# Altium project Measurement_board.PrjPcb
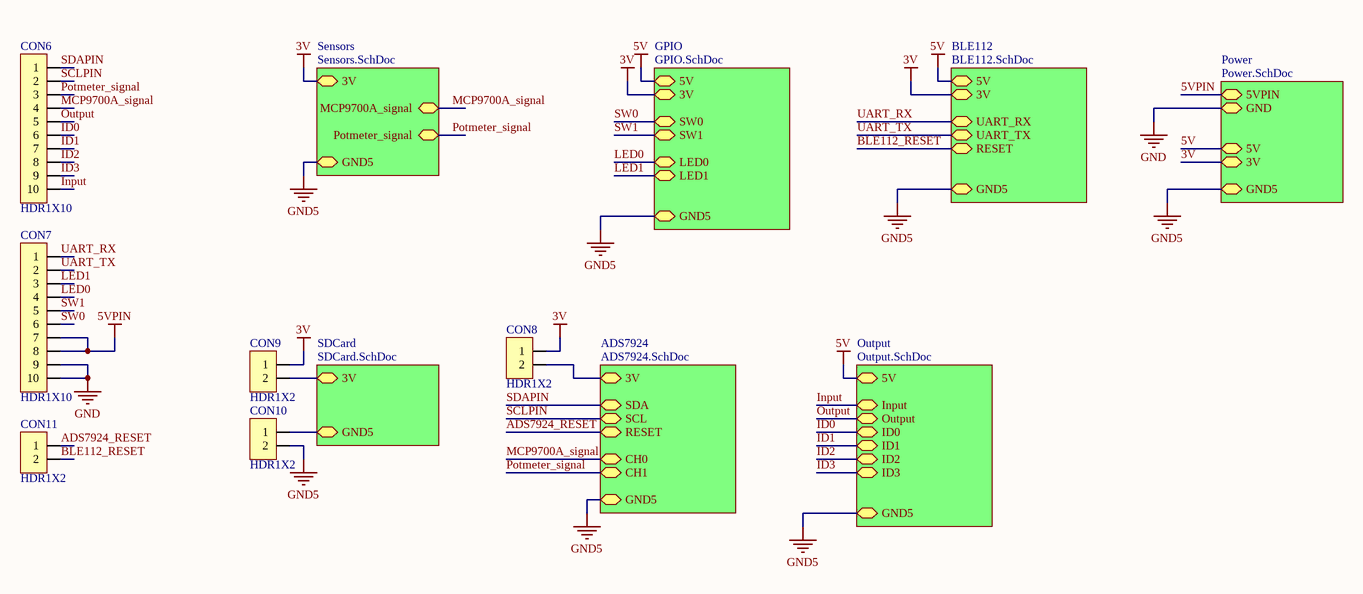
[diagram p0: Measurement_board.SchDoc]
8 sheets, 161 parts. Net scope: strictly hierarchical (ports join the sheet entries above them; power ports are local).
Board files: Measurement_board.PcbDoc, logo.PcbDoc
Sheets:
  Measurement_board.SchDoc
    SDCard = SDCard.SchDoc
    Sensors = Sensors.SchDoc
    ADS7924 = ADS7924.SchDoc
    Output = Output.SchDoc
    BLE112 = BLE112.SchDoc
    GPIO = GPIO.SchDoc
    Power = Power.SchDoc

## Sheet Measurement_board.SchDoc
size A3

### Parts
CON6  HDR1X10  [HDR1X10RAST]
CON7  HDR1X10  [HDR1X10RAST]
CON8  HDR1X2  [HDR1X2RAST]
CON9  HDR1X2  [HDR1X2RAST]
CON10  HDR1X2  [HDR1X2RAST]
CON11  HDR1X2  [HDR1X2RAST]

### Sub-sheets
ADS7924 = ADS7924.SchDoc: RESET, 3V, CH0, CH1, SDA, SCL, GND5
BLE112 = BLE112.SchDoc: RESET, 5V, 3V, UART_RX, UART_TX, GND5
GPIO = GPIO.SchDoc: LED1, 3V, 5V, SW0, SW1, LED0, GND5
Output = Output.SchDoc: GND5, ID1, ID0, 5V, ID3, ID2, Output, Input
Power = Power.SchDoc: 3V, 5VPIN, 5V, GND, GND5
SDCard = SDCard.SchDoc: 3V, GND5
Sensors = Sensors.SchDoc: MCP9700A_signal, 3V, Potmeter_signal, GND5

### Nets
3V: CON8.1 CON9.1 ; sheet Sensors/3V, sheet BLE112/3V, sheet GPIO/3V, sheet Power/3V
5V: sheet Output/5V, sheet BLE112/5V, sheet GPIO/5V, sheet Power/5V
5VPIN: CON7.7 CON7.8 ; sheet Power/5VPIN
ADS3V: CON8.2 ; sheet ADS7924/3V
GND: CON7.9 CON7.10 ; sheet Power/GND
GND5: CON10.2 ; sheet Sensors/GND5, sheet ADS7924/GND5, sheet Output/GND5, sheet BLE112/GND5, sheet GPIO/GND5, sheet Power/GND5
SDGND: CON10.1 ; sheet SDCard/GND5
SDVDD: CON9.2 ; sheet SDCard/3V
ADS7924_RESET: CON11.1 ; sheet ADS7924/RESET
BLE112_RESET: CON11.2 ; sheet BLE112/RESET
ID0: CON6.6 ; sheet Output/ID0
ID1: CON6.7 ; sheet Output/ID1
ID2: CON6.8 ; sheet Output/ID2
ID3: CON6.9 ; sheet Output/ID3
Input: CON6.10 ; sheet Output/Input
LED0: CON7.4 ; sheet GPIO/LED0
LED1: CON7.3 ; sheet GPIO/LED1
MCP9700A_signal: CON6.4 ; sheet Sensors/MCP9700A_signal, sheet ADS7924/CH0
Output: CON6.5 ; sheet Output/Output
Potmeter_signal: CON6.3 ; sheet Sensors/Potmeter_signal, sheet ADS7924/CH1
SCLPIN: CON6.2 ; sheet ADS7924/SCL
SDAPIN: CON6.1 ; sheet ADS7924/SDA
SW0: CON7.6 ; sheet GPIO/SW0
SW1: CON7.5 ; sheet GPIO/SW1
UART_RX: CON7.1 ; sheet BLE112/UART_RX
UART_TX: CON7.2 ; sheet BLE112/UART_TX

## Sheet SDCard.SchDoc
size A4
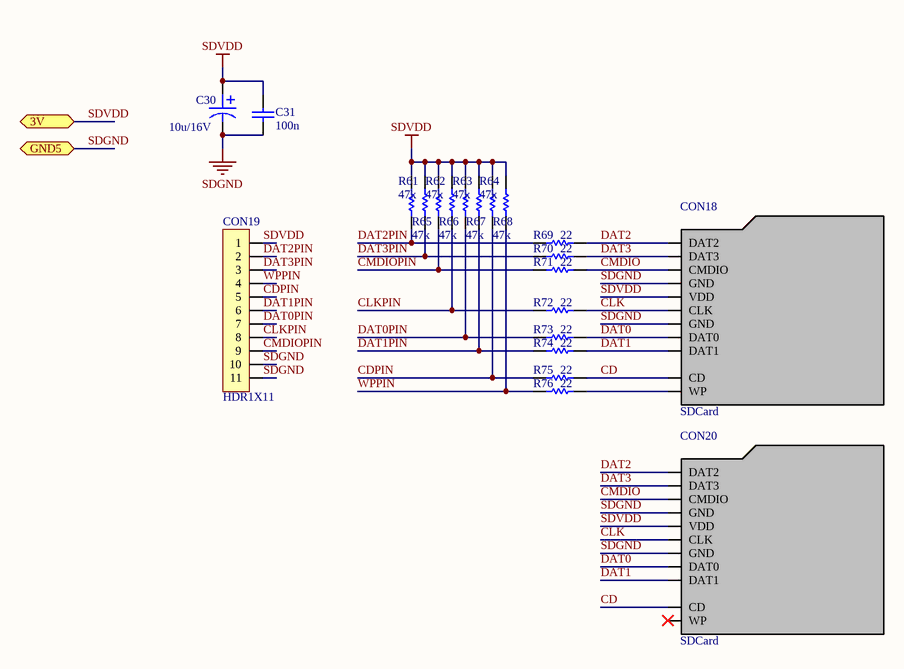
[diagram p1: SDCard.SchDoc]

### Parts
C30  10u/16V  [CA]
C31  100n  [0805C]
CON18  SDCard  [SDCard]
CON19  HDR1X11  [HDR1X11RAST]
CON20  SDCard  [MICROSDCARD]
R61  47k  [0805R]
R62  47k  [0805R]
R63  47k  [0805R]
R64  47k  [0805R]
R65  47k  [0805R]
R66  47k  [0805R]
R67  47k  [0805R]
R68  47k  [0805R]
R69  22  [0805R]
R70  22  [0805R]
R71  22  [0805R]
R72  22  [0805R]
R73  22  [0805R]
R74  22  [0805R]
R75  22  [0805R]
R76  22  [0805R]

### Ports
3V, GND5

### Nets
SDGND: C30.2 C31.1 CON18.GND CON19.10 CON19.11 CON20.GND ; port GND5
SDVDD: C30.1 C31.2 CON18.VDD CON19.1 CON20.VDD R61.2 R62.2 R63.2 R64.2 R65.2 R66.2 R67.2 R68.2 ; port 3V
CD: CON18.CD CON20.CD R75.2
CDPIN: CON19.5 R64.1 R75.1
CLK: CON18.CLK CON20.CLK R72.2
CLKPIN: CON19.8 R66.1 R72.1
CMDIO: CON18.CMDIO CON20.CMDIO R71.2
CMDIOPIN: CON19.9 R62.1 R71.1
DAT0: CON18.DAT0 CON20.DAT0 R73.2
DAT0PIN: CON19.7 R63.1 R73.1
DAT1: CON18.DAT1 CON20.DAT1 R74.2
DAT1PIN: CON19.6 R67.1 R74.1
DAT2: CON18.DAT2 CON20.DAT2 R69.2
DAT2PIN: CON19.2 R61.1 R69.1
DAT3: CON18.DAT3 CON20.DAT3 R70.2
DAT3PIN: CON19.3 R65.1 R70.1
WPPIN: CON19.4 R68.1 R76.1
NetCON18_WP: CON18.WP R76.2

Not connected (* = marked no-connect by the designer): CON20 WP*

### Library data of the parts
C30 = ELECTROLYTIC_CAPACITOR: Value: 10u/16V
C31 = CAPACITOR: Value: 100n
CON20 = SDCard: pin to pad: WP>none
R61-R76 = RESISTOR
  R61-R68: Value: 47k
  R69-R76: Value: 22

## Sheet Sensors.SchDoc
size A4
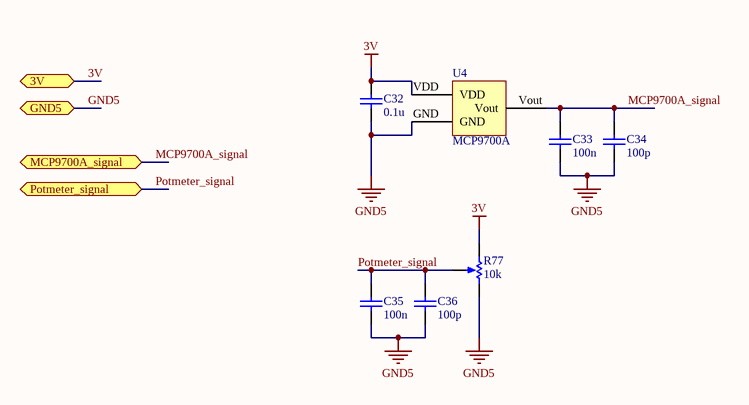
[diagram p2: Sensors.SchDoc]

### Parts
C32  0.1u  [0805C]
C33  100n  [0805C]
C34  100p  [0805C]
C35  100n  [0805C]
C36  100p  [0805C]
R77  10k  [TRIM_POT]
U4  MCP9700A  [TO-92]

### Ports
3V, GND5, MCP9700A_signal, Potmeter_signal

### Nets
3V: C32.2 R77.1 U4.VDD ; port 3V
GND5: C32.1 C33.1 C34.1 C35.1 C36.1 R77.0 U4.GND ; port GND5
MCP9700A_signal: C33.2 C34.2 U4.Vout ; port MCP9700A_signal
Potmeter_signal: C35.2 C36.2 R77.2 ; port Potmeter_signal

### Library data of the parts
C32-C36 = CAPACITOR
  C32: Value: 0.1u
  C33 C35: Value: 100n
  C34 C36: Value: 100p
R77 = Trim_pot: Value: 10k
U4 = MCP9700A: HESTORE: 1003.3751; FARNELL: 1332164

## Sheet ADS7924.SchDoc
size A4
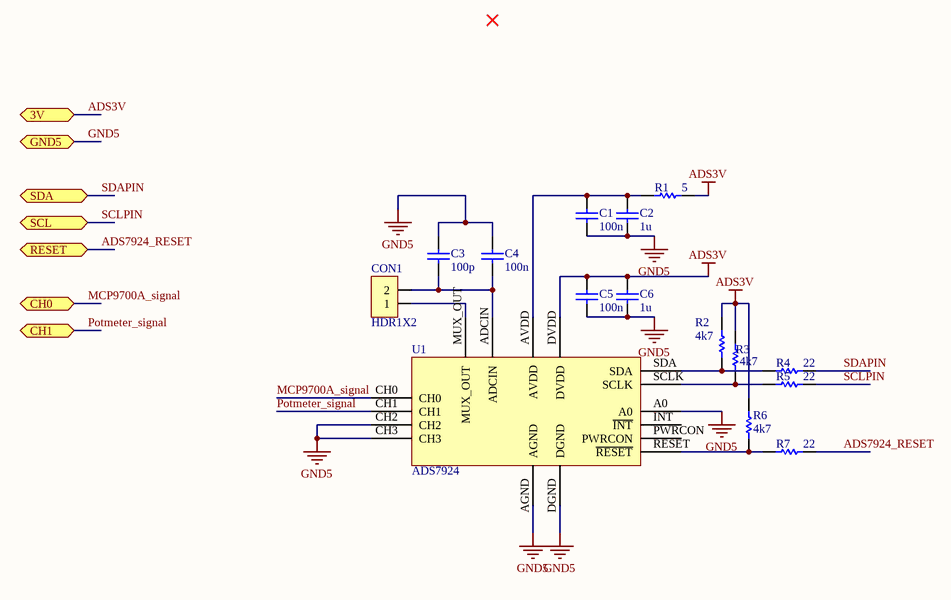
[diagram p3: ADS7924.SchDoc]

### Parts
C1  100n  [0805C]
C2  1u  [0805C]
C3  100p  [0805C]
C4  100n  [0805C]
C5  100n  [0805C]
C6  1u  [0805C]
CON1  HDR1X2  [HDR1X2RAST]
R1  5  [0805R]
R2  4k7  [0805R]
R3  4k7  [0805R]
R4  22  [0805R]
R5  22  [0805R]
R6  4k7  [0805R]
R7  22  [0805R]
U1  ADS7924  [QFN16 - HAND]

### Ports
3V, CH0, CH1, GND5, RESET, SCL, SDA

### Nets
ADS3V: C5.2 C6.2 R1.2 R2.2 R3.2 R6.2 U1.DVDD ; port 3V
GND5: C1.1 C2.1 C3.2 C4.2 C5.1 C6.1 U1.A0 U1.AGND U1.CH2 U1.CH3 U1.DGND ; port GND5
ADS7924_RESET: R7.1 ; port RESET
MCP9700A_signal: U1.CH0 ; port CH0
Potmeter_signal: U1.CH1 ; port CH1
SCLPIN: R5.1 ; port SCL
SDAPIN: R4.1 ; port SDA
NetC1_2: C1.2 C2.2 R1.1 U1.AVDD
NetC3_1: C3.1 C4.1 CON1.2 U1.ADCIN
NetCON1_1: CON1.1 U1.MUX_OUT
NetR2_1: R2.1 R4.2 U1.SDA
NetR3_1: R3.1 R5.2 U1.SCLK
NetR6_1: R6.1 R7.2 U1.RESET(~{RESET})

Not connected (* = marked no-connect by the designer): U1 INT(~{INT}) PWRCON

### Library data of the parts
C1-C6 = CAPACITOR
  C1 C4 C5: Value: 100n
  C2 C6: Value: 1u
  C3: Value: 100p
R1-R7 = RESISTOR
  R1: Value: 5
  R2 R3 R6: Value: 4k7
  R4 R5 R7: Value: 22
U1 = ADS7924: FARNELL: 2496420

## Sheet Output.SchDoc
size A4
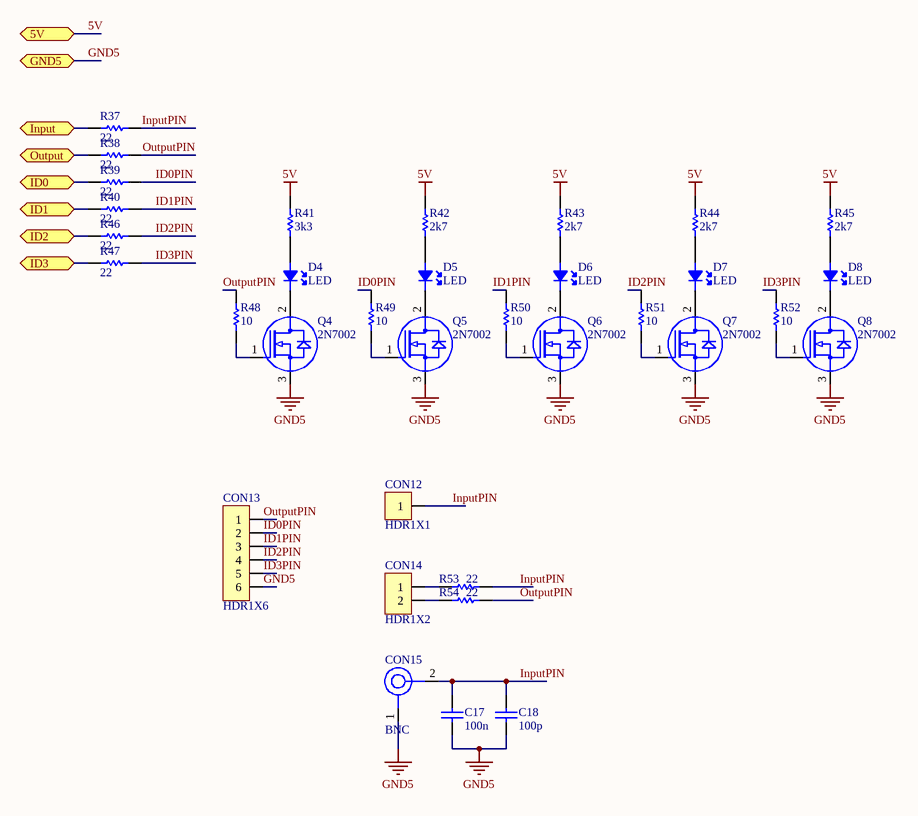
[diagram p4: Output.SchDoc]

### Parts
C17  100n  [0805C]
C18  100p  [0805C]
CON12  HDR1X1  [HDR1X1]
CON13  HDR1X6  [HDR1X6RAST]
CON14  HDR1X2  [HDR1X2RAST]
CON15  BNC  [BNC_THD]
D4  LED  [0805LED]
D5  LED  [0805LED]
D6  LED  [0805LED]
D7  LED  [0805LED]
D8  LED  [0805LED]
Q4  2N7002  [SOT23]
Q5  2N7002  [SOT23]
Q6  2N7002  [SOT23]
Q7  2N7002  [SOT23]
Q8  2N7002  [SOT23]
R37  22  [0805R]
R38  22  [0805R]
R39  22  [0805R]
R40  22  [0805R]
R41  3k3  [0805R]
R42  2k7  [0805R]
R43  2k7  [0805R]
R44  2k7  [0805R]
R45  2k7  [0805R]
R46  22  [0805R]
R47  22  [0805R]
R48  10  [0805R]
R49  10  [0805R]
R50  10  [0805R]
R51  10  [0805R]
R52  10  [0805R]
R53  22  [0805R]
R54  22  [0805R]

### Ports
5V, GND5, ID0, ID1, ID2, ID3, Input, Output

### Nets
5V: R41.2 R42.2 R43.2 R44.2 R45.2 ; port 5V
GND5: C17.1 C18.1 CON13.6 CON15.1 Q4.3(SOURCE) Q5.3(SOURCE) Q6.3(SOURCE) Q7.3(SOURCE) Q8.3(SOURCE) ; port GND5
ID0: R39.1 ; port ID0
ID0PIN: CON13.2 R39.2 R49.2
ID1: R40.1 ; port ID1
ID1PIN: CON13.3 R40.2 R50.2
ID2: R46.1 ; port ID2
ID2PIN: CON13.4 R46.2 R51.2
ID3: R47.1 ; port ID3
ID3PIN: CON13.5 R47.2 R52.2
Input: R37.1 ; port Input
InputPIN: C17.2 C18.2 CON12.1 CON15.2 R37.2 R53.2
Output: R38.1 ; port Output
OutputPIN: CON13.1 R38.2 R48.2 R54.2
NetCON14_1: CON14.1 R53.1
NetCON14_2: CON14.2 R54.1
NetD4_1: D4.1(A) R41.1
NetD4_2: D4.2(K) Q4.2(DRAIN)
NetD5_1: D5.1(A) R42.1
NetD5_2: D5.2(K) Q5.2(DRAIN)
NetD6_1: D6.1(A) R43.1
NetD6_2: D6.2(K) Q6.2(DRAIN)
NetD7_1: D7.1(A) R44.1
NetD7_2: D7.2(K) Q7.2(DRAIN)
NetD8_1: D8.1(A) R45.1
NetD8_2: D8.2(K) Q8.2(DRAIN)
NetQ4_1: Q4.1(GATE) R48.1
NetQ5_1: Q5.1(GATE) R49.1
NetQ6_1: Q6.1(GATE) R50.1
NetQ7_1: Q7.1(GATE) R51.1
NetQ8_1: Q8.1(GATE) R52.1

### Library data of the parts
C17 C18 = CAPACITOR
  C17: Value: 100n
  C18: Value: 100p
D4 = LED: COLOR: RED
D5-D8 = LED: COLOR: ORANGE
R37-R54 = RESISTOR
  R37-R40 R46 R47 R53 R54: Value: 22
  R41: Value: 3k3
  R42-R45: Value: 2k7
  R48-R52: Value: 10
CON15 = BNC: FARNELL: 1076289
Q4-Q8 = 2N7002: FARNELL: 2306371

## Sheet BLE112.SchDoc
size A4
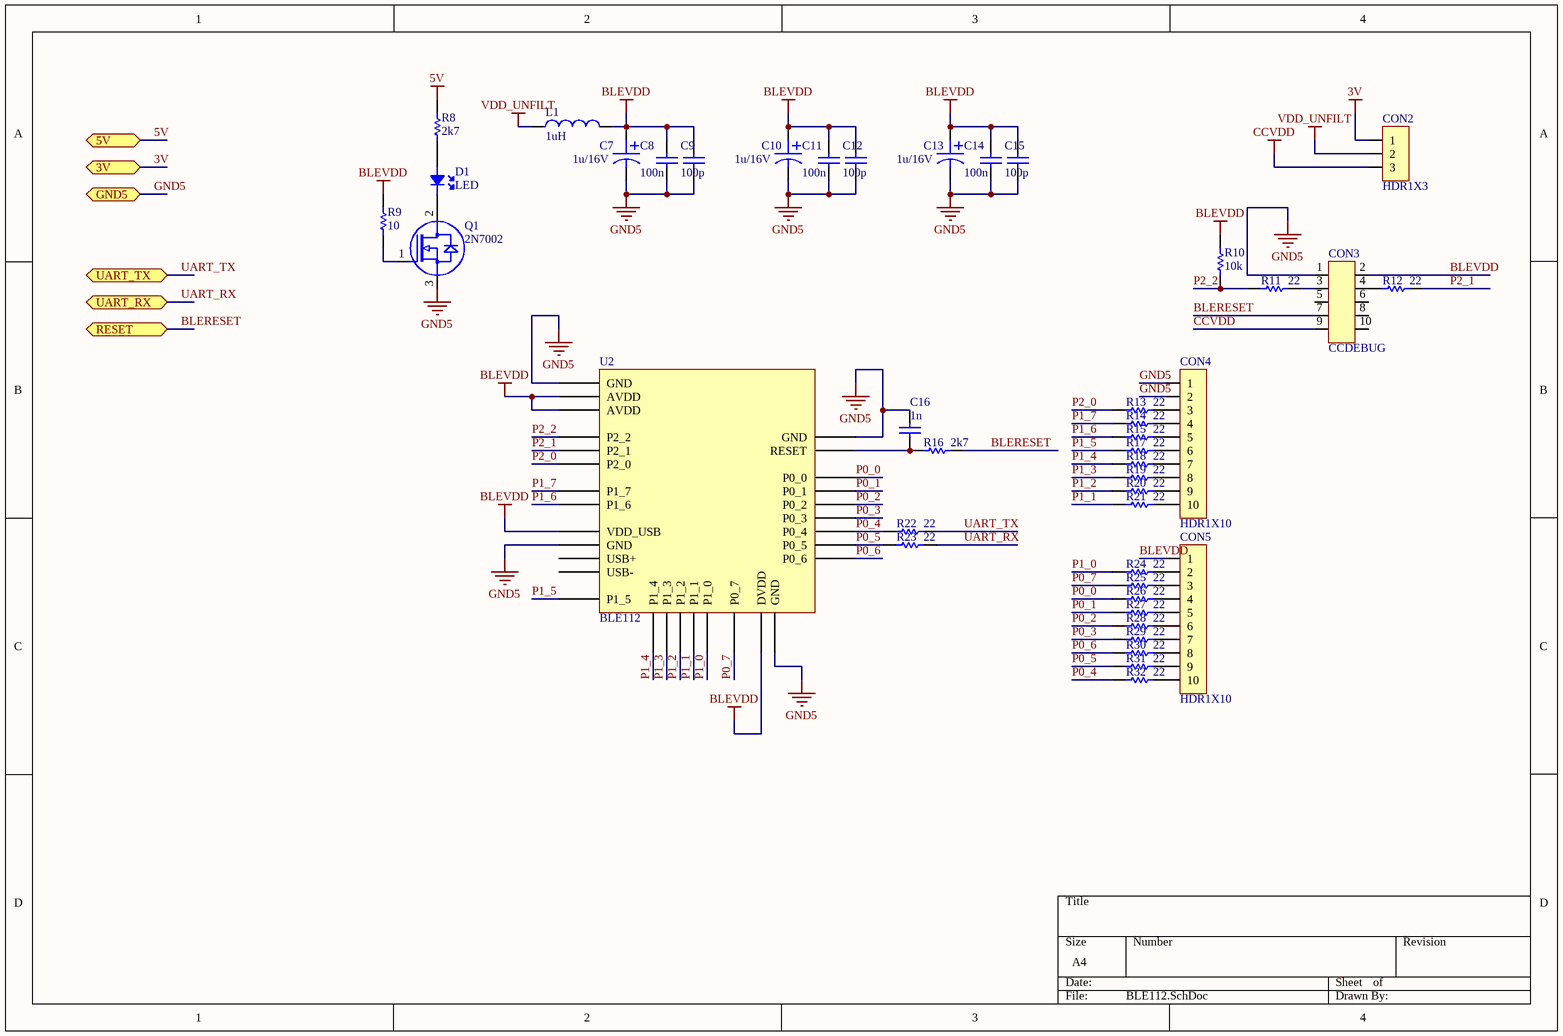
[diagram p5: BLE112.SchDoc]

### Parts
C7  1u/16V  [CA]
C8  100n  [0805C]
C9  100p  [0805C]
C10  1u/16V  [CA]
C11  100n  [0805C]
C12  100p  [0805C]
C13  1u/16V  [CA]
C14  100n  [0805C]
C15  100p  [0805C]
C16  1n  [0805C]
CON2  HDR1X3  [HDR1X3RAST]
CON3  CCDEBUG  [HDR2X5_CC]
CON4  HDR1X10  [HDR1X10RAST]
CON5  HDR1X10  [HDR1X10RAST]
D1  LED  [0805LED]
L1  1uH  [0805L]
Q1  2N7002  [SOT23]
R8  2k7  [0805R]
R9  10  [0805R]
R10  10k  [0805R]
R11  22  [0805R]
R12  22  [0805R]
R13  22  [0805R]
R14  22  [0805R]
R15  22  [0805R]
R16  2k7  [0805R]
R17  22  [0805R]
R18  22  [0805R]
R19  22  [0805R]
R20  22  [0805R]
R21  22  [0805R]
R22  22  [0805R]
R23  22  [0805R]
R24  22  [0805R]
R25  22  [0805R]
R26  22  [0805R]
R27  22  [0805R]
R28  22  [0805R]
R29  22  [0805R]
R30  22  [0805R]
R31  22  [0805R]
R32  22  [0805R]
U2  BLE112  [BLE112]

### Ports
3V, 5V, GND5, RESET, UART_RX, UART_TX

### Nets
3V: CON2.1 ; port 3V
5V: R8.2 ; port 5V
BLEVDD: C7.1 C8.2 C9.2 C10.1 C11.2 C12.2 C13.1 C14.2 C15.2 CON3.2 CON5.1 L1.2 R9.2 R10.1 U2.AVDD U2.DVDD U2.VDD_USB
CCVDD: CON2.3 CON3.9
GND5: C7.2 C8.1 C9.1 C10.2 C11.1 C12.1 C13.2 C14.1 C15.1 C16.2 CON3.1 CON4.1 CON4.2 Q1.3(SOURCE) U2.GND ; port GND5
VDD_UNFILT: CON2.2 L1.1
BLERESET: CON3.7 R16.1 ; port RESET  [project net BLE112_RESET]
P0_0: R26.2 U2.P0_0
P0_1: R27.2 U2.P0_1
P0_2: R28.2 U2.P0_2
P0_3: R29.2 U2.P0_3
P0_4: R22.2 R32.2 U2.P0_4
P0_5: R23.2 R31.2 U2.P0_5
P0_6: R30.2 U2.P0_6
P0_7: R25.2 U2.P0_7
P1_0: R24.2 U2.P1_0
P1_1: R21.2 U2.P1_1
P1_2: R20.2 U2.P1_2
P1_3: R19.2 U2.P1_3
P1_4: R18.2 U2.P1_4
P1_5: R17.2 U2.P1_5
P1_6: R15.2 U2.P1_6
P1_7: R14.2 U2.P1_7
P2_0: R13.2 U2.P2_0
P2_1: R12.1 U2.P2_1
P2_2: R10.2 R11.2 U2.P2_2
UART_RX: R23.1 ; port UART_RX
UART_TX: R22.1 ; port UART_TX
NetC16_1: C16.1 R16.2 U2.RESET
NetCON3_3: CON3.3 R11.1
NetCON3_4: CON3.4 R12.2
NetCON4_3: CON4.3 R13.1
NetCON4_4: CON4.4 R14.1
NetCON4_5: CON4.5 R15.1
NetCON4_6: CON4.6 R17.1
NetCON4_7: CON4.7 R18.1
NetCON4_8: CON4.8 R19.1
NetCON4_9: CON4.9 R20.1
NetCON4_10: CON4.10 R21.1
NetCON5_2: CON5.2 R24.1
NetCON5_3: CON5.3 R25.1
NetCON5_4: CON5.4 R26.1
NetCON5_5: CON5.5 R27.1
NetCON5_6: CON5.6 R28.1
NetCON5_7: CON5.7 R29.1
NetCON5_8: CON5.8 R30.1
NetCON5_9: CON5.9 R31.1
NetCON5_10: CON5.10 R32.1
NetD1_1: D1.1(A) R8.1
NetD1_2: D1.2(K) Q1.2(DRAIN)
NetQ1_1: Q1.1(GATE) R9.1

Not connected (* = marked no-connect by the designer): CON3 5 6 8 10; U2 USB+ USB-

### Library data of the parts
C7 C10 C13 = ELECTROLYTIC_CAPACITOR: Value: 1u/16V
C8 C9 C11 C12 C14-C16 = CAPACITOR
  C8 C11 C14: Value: 100n
  C9 C12 C15: Value: 100p
  C16: Value: 1n
D1 = LED: COLOR: GREEN
L1 = Inductor: Value: 1uH
R8-R32 = RESISTOR
  R8 R16: Value: 2k7
  R9: Value: 10
  R10: Value: 10k
  R11-R15 R17-R32: Value: 22
Q1 = 2N7002: FARNELL: 2306371
U2 = BLE112: FARNELL: 2113858

## Sheet GPIO.SchDoc
size A4
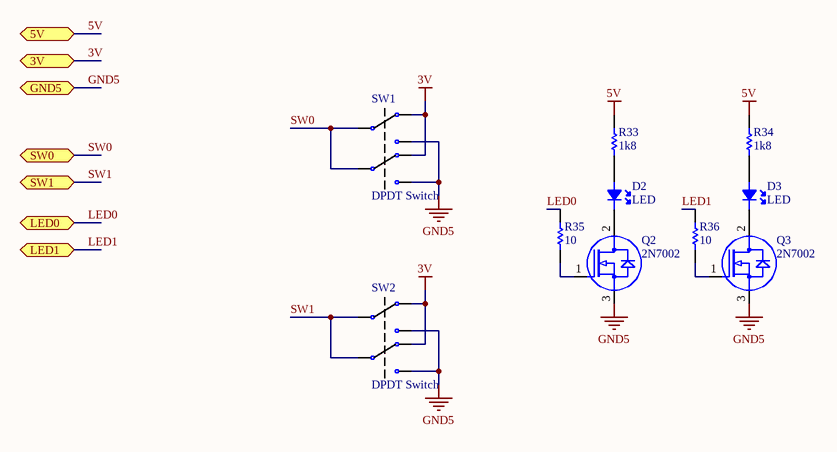
[diagram p6: GPIO.SchDoc]

### Parts
D2  LED  [0805LED]
D3  LED  [0805LED]
Q2  2N7002  [SOT23]
Q3  2N7002  [SOT23]
R33  1k8  [0805R]
R34  1k8  [0805R]
R35  10  [0805R]
R36  10  [0805R]
SW1  DPDT Switch  [DPDT]
SW2  DPDT Switch  [DPDT]

### Ports
3V, 5V, GND5, LED0, LED1, SW0, SW1

### Nets
3V: SW1.1 SW1.4 SW2.1 SW2.4 ; port 3V
5V: R33.2 R34.2 ; port 5V
GND5: Q2.3(SOURCE) Q3.3(SOURCE) SW1.3 SW1.6 SW2.3 SW2.6 ; port GND5
LED0: R35.2 ; port LED0
LED1: R36.2 ; port LED1
SW0: SW1.2 SW1.5 ; port SW0
SW1: SW2.2 SW2.5 ; port SW1
NetD2_1: D2.1(A) R33.1
NetD2_2: D2.2(K) Q2.2(DRAIN)
NetD3_1: D3.1(A) R34.1
NetD3_2: D3.2(K) Q3.2(DRAIN)
NetQ2_1: Q2.1(GATE) R35.1
NetQ3_1: Q3.1(GATE) R36.1

### Library data of the parts
D2 D3 = LED: COLOR: BLUE
R33-R36 = RESISTOR
  R33 R34: Value: 1k8
  R35 R36: Value: 10
SW1 SW2 = DPDT_Switch: FARNELL: 2320019
Q2 Q3 = 2N7002: FARNELL: 2306371

## Sheet Power.SchDoc
size A4
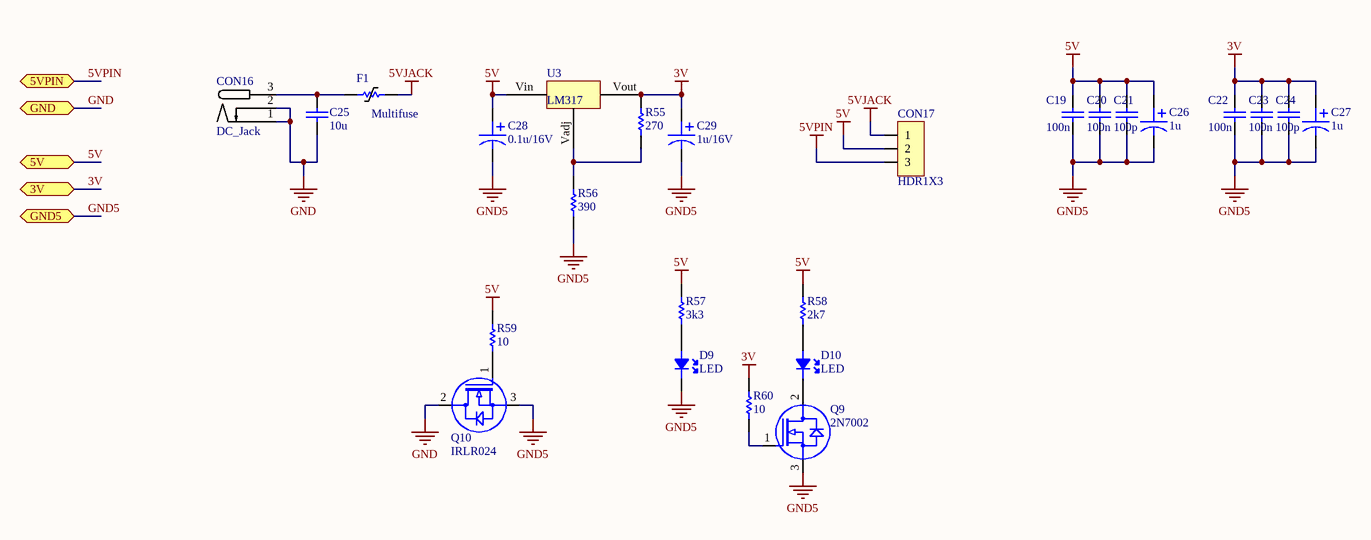
[diagram p7: Power.SchDoc]

### Parts
C19  100n  [0805C]
C20  100n  [0805C]
C21  100p  [0805C]
C22  100n  [0805C]
C23  100n  [0805C]
C24  100p  [0805C]
C25  10u  [0805C]
C26  1u  [CA]
C27  1u  [CA]
C28  0.1u/16V  [CA]
C29  1u/16V  [CA]
CON16  DC_Jack  [DC_JACK_CIRCLE]
CON17  HDR1X3  [HDR1X3RAST]
D9  LED  [0805LED]
D10  LED  [0805LED]
F1  Multifuse  [1210FUSE]
Q9  2N7002  [SOT23]
Q10  IRLR024  [TO-252AA]
R55  270  [0805R]
R56  390  [0805R]
R57  3k3  [0805R]
R58  2k7  [0805R]
R59  10  [0805R]
R60  10  [0805R]
U3  LM317  [DPAK-3]

### Ports
3V, 5V, 5VPIN, GND, GND5

### Nets
3V: C22.2 C23.2 C24.2 C27.1 C29.1 R55.2 R60.2 U3.Vout ; port 3V
5V: C19.2 C20.2 C21.2 C26.1 C28.1 CON17.2 R57.2 R58.2 R59.2 U3.Vin ; port 5V
5VJACK: CON17.1 F1.2
5VPIN: CON17.3 ; port 5VPIN
GND: C25.1 CON16.1 CON16.2 Q10.2(DRAIN) ; port GND
GND5: C19.1 C20.1 C21.1 C22.1 C23.1 C24.1 C26.2 C27.2 C28.2 C29.2 D9.2(K) Q9.3(SOURCE) Q10.3(SOURCE) R56.1 ; port GND5
NetC25_2: C25.2 CON16.3 F1.1
NetD9_1: D9.1(A) R57.1
NetD10_1: D10.1(A) R58.1
NetD10_2: D10.2(K) Q9.2(DRAIN)
NetQ9_1: Q9.1(GATE) R60.1
NetQ10_1: Q10.1(GATE) R59.1
NetR55_1: R55.1 R56.2 U3.Vadj

### Library data of the parts
C19-C25 = CAPACITOR
  C19 C20 C22 C23: Value: 100n
  C21 C24: Value: 100p
  C25: Value: 10u
C26-C29 = ELECTROLYTIC_CAPACITOR
  C26 C27: Value: 1u
  C28: Value: 0.1u/16V
  C29: Value: 1u/16V
D9 = LED: COLOR: RED
D10 = LED: COLOR: GREEN
R55-R60 = RESISTOR
  R55: Value: 270
  R56: Value: 390
  R57: Value: 3k3
  R58: Value: 2k7
  R59 R60: Value: 10
Q9 = 2N7002: FARNELL: 2306371
Q10 = IRLR024: FARNELL: 2468052RL
U3 = LM317: LOMEX: 44-02-23

## Nets that join several sheets
3V: Measurement_board (CON8.1 CON9.1), Sensors (C32.2 R77.1 U4.VDD), BLE112 (CON2.1), GPIO (SW1.1 SW1.4 SW2.1 SW2.4), Power (8 pins)
5V: Output (5 pins), BLE112 (R8.2), GPIO (R33.2 R34.2), Power (10 pins)
5VPIN: Measurement_board (CON7.7 CON7.8), Power (CON17.3)
ADS3V: Measurement_board (CON8.2), ADS7924 (7 pins)
GND: Measurement_board (CON7.9 CON7.10), Power (C25.1 CON16.1 CON16.2 Q10.2)
GND5: Measurement_board (CON10.2), Sensors (7 pins), ADS7924 (11 pins), Output (9 pins), BLE112 (15 pins), GPIO (6 pins), Power (14 pins)
SDGND: Measurement_board (CON10.1), SDCard (6 pins)
SDVDD: Measurement_board (CON9.2), SDCard (13 pins)
ADS7924_RESET: Measurement_board (CON11.1), ADS7924 (R7.1)
BLE112_RESET: Measurement_board (CON11.2), BLE112 (CON3.7 R16.1)
ID0: Measurement_board (CON6.6), Output (R39.1)
ID1: Measurement_board (CON6.7), Output (R40.1)
ID2: Measurement_board (CON6.8), Output (R46.1)
ID3: Measurement_board (CON6.9), Output (R47.1)
Input: Measurement_board (CON6.10), Output (R37.1)
LED0: Measurement_board (CON7.4), GPIO (R35.2)
LED1: Measurement_board (CON7.3), GPIO (R36.2)
MCP9700A_signal: Measurement_board (CON6.4), Sensors (C33.2 C34.2 U4.Vout), ADS7924 (U1.CH0)
Output: Measurement_board (CON6.5), Output (R38.1)
Potmeter_signal: Measurement_board (CON6.3), Sensors (C35.2 C36.2 R77.2), ADS7924 (U1.CH1)
SCLPIN: Measurement_board (CON6.2), ADS7924 (R5.1)
SDAPIN: Measurement_board (CON6.1), ADS7924 (R4.1)
SW0: Measurement_board (CON7.6), GPIO (SW1.2 SW1.5)
SW1: Measurement_board (CON7.5), GPIO (SW2.2 SW2.5)
UART_RX: Measurement_board (CON7.1), BLE112 (R23.1)
UART_TX: Measurement_board (CON7.2), BLE112 (R22.1)